# EasyEDA schematic BUS-PSU-PowerIO.json
TITLE: Sheet_1; REV: 1.0; Date: 2025-05-27; Sheet: 1/1; Drawn By: Unknownmephi; Company: Your Company
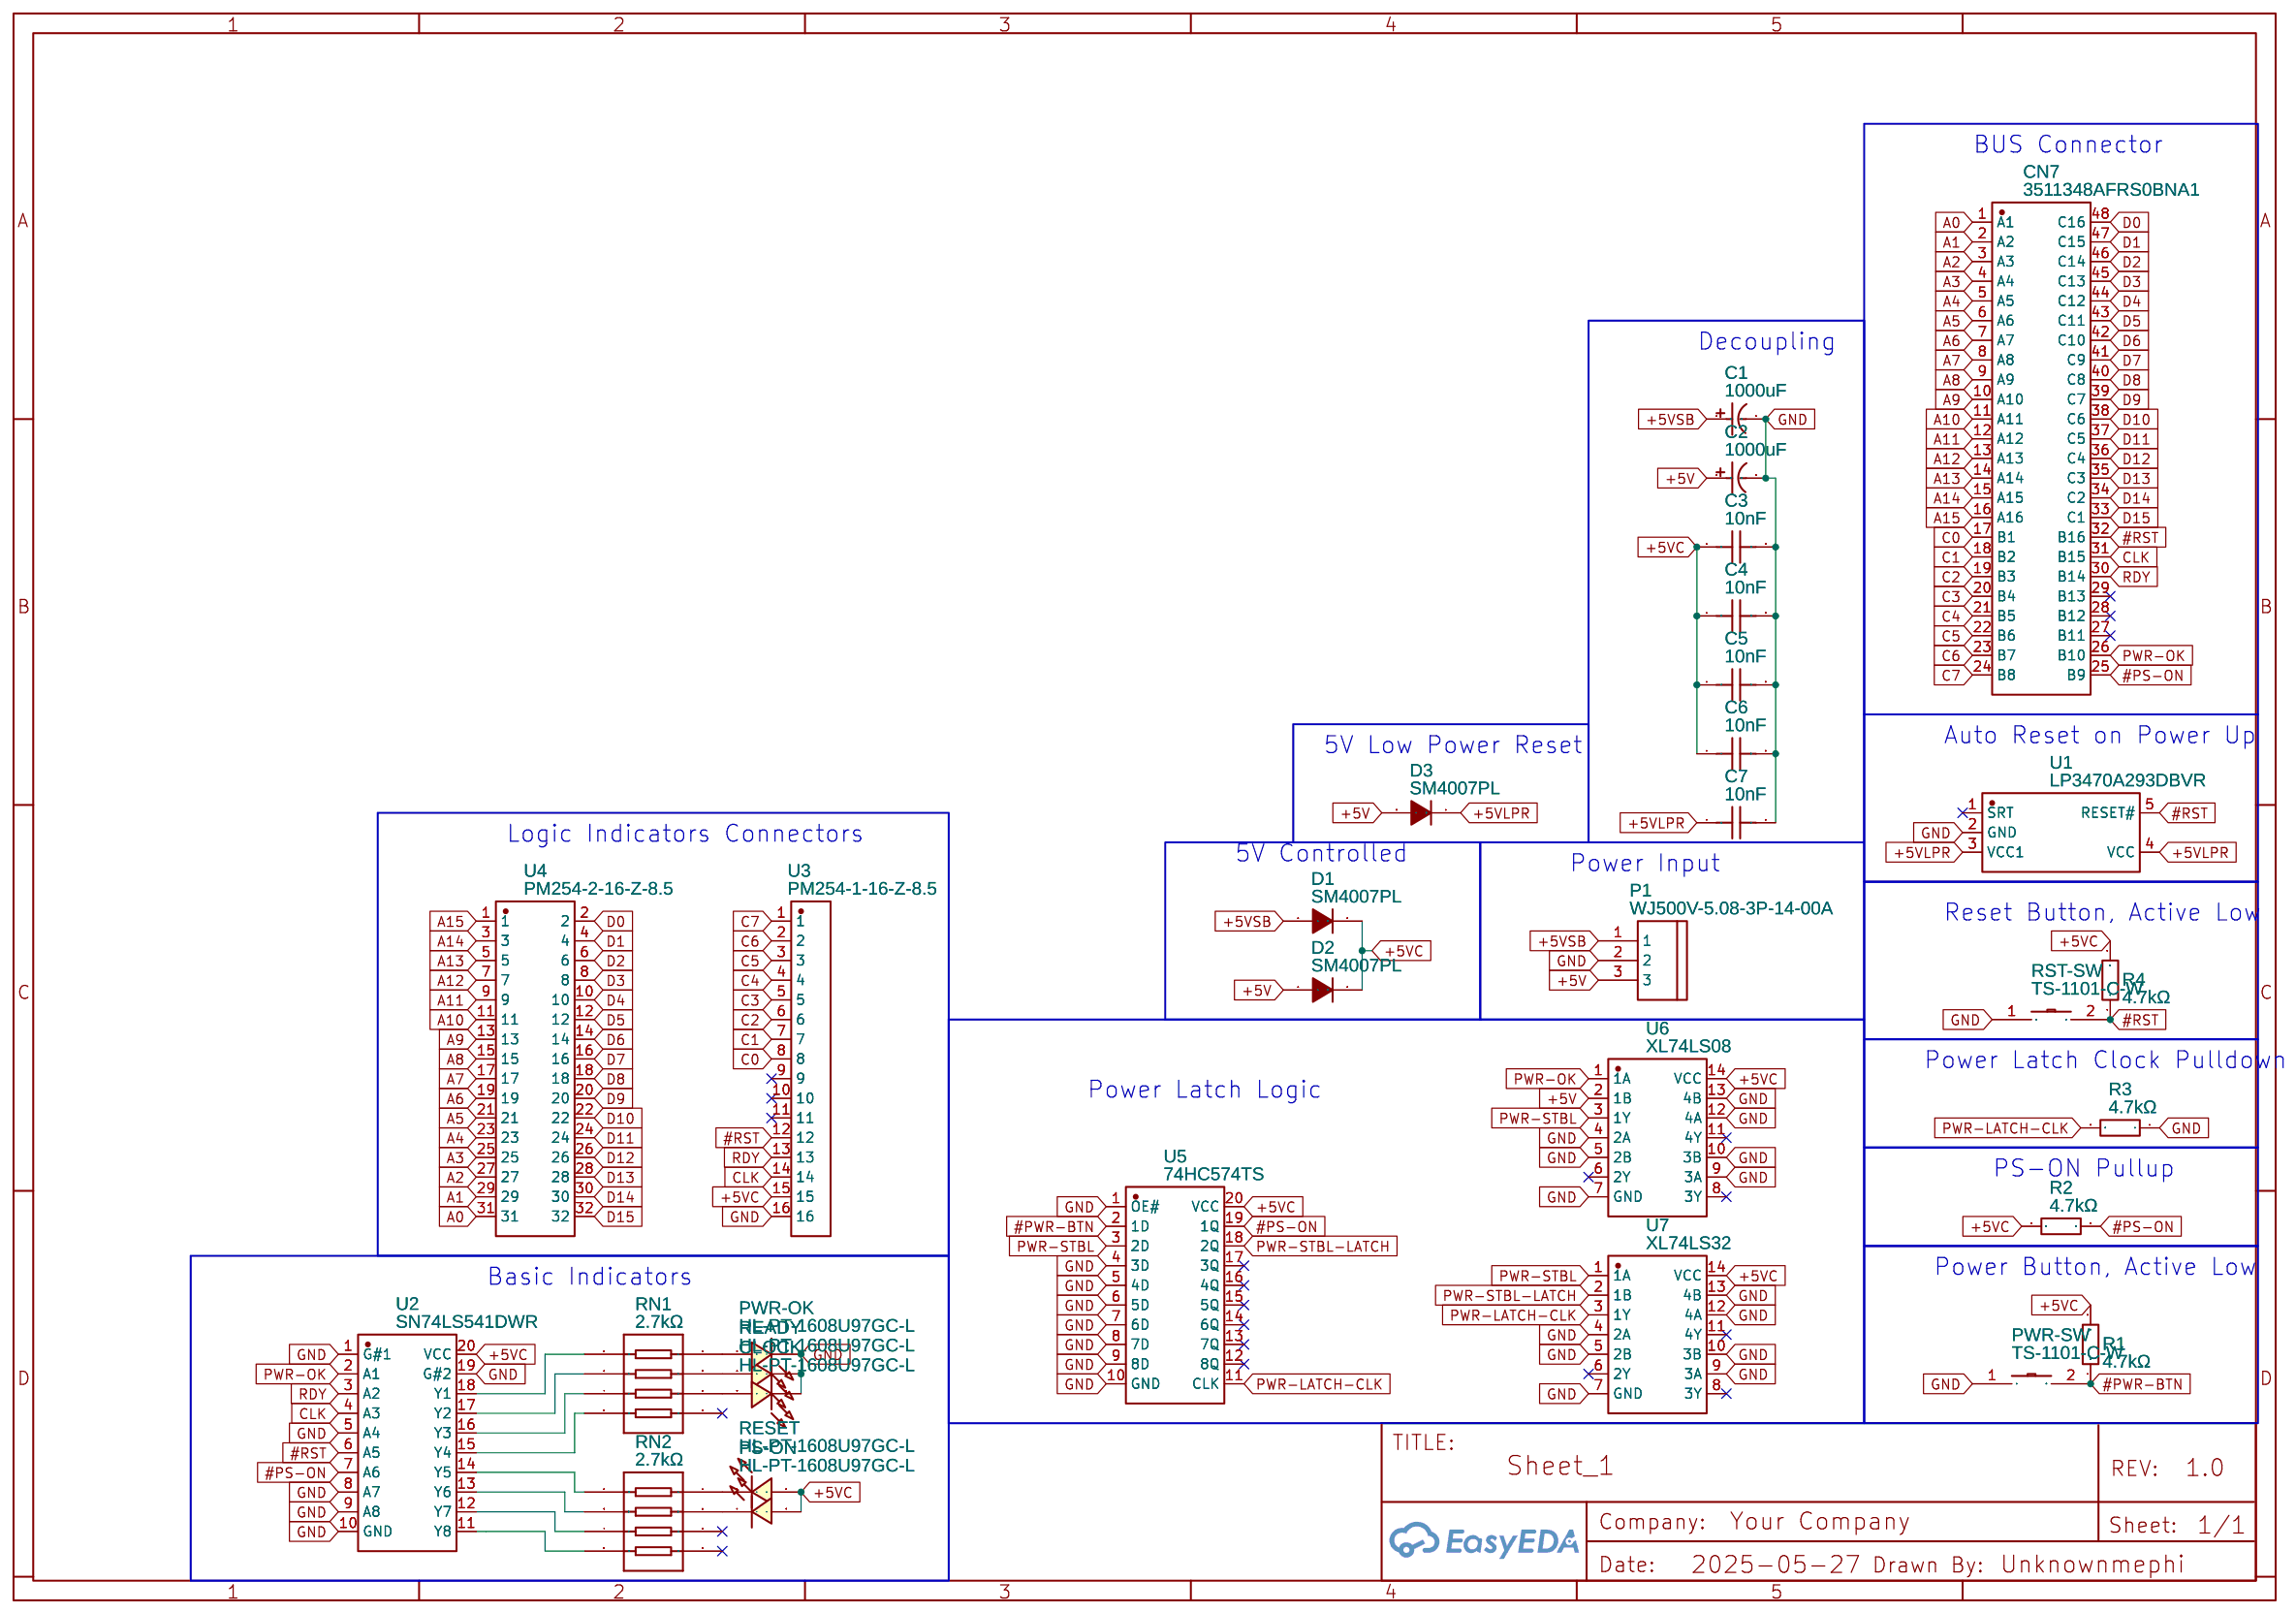
[diagram p0: schematic sheet]

## Parts
C1  1000uF  [CAP-TH_BD8.0-P3.50-D0.6-FD]
C2  1000uF  [CAP-TH_BD8.0-P3.50-D0.6-FD]
C3  10nF  [C0805]
C4  10nF  [C0805]
C5  10nF  [C0805]
C6  10nF  [C0805]
C7  10nF  [C0805]
CLOCK  HL-PT-1608U97GC-L  [LED0603-RD_GREEN]
CN7  3511348AFRS0BNA1  [CONN-TH_3511348AFRS0BNA1]
D1  SM4007PL  [SOD-123F_L2.8-W1.8-LS3.7-RD]
D2  SM4007PL  [SOD-123F_L2.8-W1.8-LS3.7-RD]
D3  SM4007PL  [SOD-123F_L2.8-W1.8-LS3.7-RD]
P1  WJ500V-5.08-3P-14-00A  [CONN-TH_3P-P5.00_WJ500V-5.08-3P]
PS-ON  HL-PT-1608U97GC-L  [LED0603-RD_GREEN]
PWR-OK  HL-PT-1608U97GC-L  [LED0603-RD_GREEN]
PWR-SW  TS-1101-C-W  [SW-SMD_L6.0-W3.3-LS8.0]
R1  4.7kΩ  [R0805]
R2  4.7kΩ  [R0805]
R3  4.7kΩ  [R0805]
R4  4.7kΩ  [R0805]
READY  HL-PT-1608U97GC-L  [LED0603-RD_GREEN]
RESET  HL-PT-1608U97GC-L  [LED0603-RD_GREEN]
RN1  2.7kΩ  [RES-ARRAY-SMD_0603-8P-L3.2-W1.6-BL]
RN2  2.7kΩ  [RES-ARRAY-SMD_0603-8P-L3.2-W1.6-BL]
RST-SW  TS-1101-C-W  [SW-SMD_L6.0-W3.3-LS8.0]
U1  LP3470A293DBVR  [SOT-23-5_L2.9-W1.6-P0.95-LS2.8-BR]
U2  SN74LS541DWR  [SOIC-20_L12.8-W7.5-P1.27-LS10.3-BL]
U3  PM254-1-16-Z-8.5  [HDR-TH_16P-P2.54-V-F-A]
U4  PM254-2-16-Z-8.5  [HDR-TH_32P-P2.54-V-F-R2-C16-S2.54]
U5  74HC574TS  [SOIC-20_L13.0-W7.6-P1.27-LS10.3-BL]
U6  XL74LS08  [SOP-14_L8.6-W3.9-P1.27-LS6.0-BL]
U7  XL74LS32  [SOP-14_L8.6-W3.9-P1.27-LS6.0-BL]

## Library data of the parts
C1 C2 = 1000uF 10V 8*12: Supplier: LCSC; Manufacturer: CX(承兴); Manufacturer Part: KM108M010F12RR0VH2FP0; Supplier Part: C10752; JLCPCB Part Class: Extended Part
C3-C7 = CC0805KRX7R9BB103: Supplier: LCSC; Manufacturer: YAGEO(国巨); Supplier Part: C83170; JLCPCB Part Class: Extended Part
CLOCK PS-ON PWR-OK READY RESET = HL-PT-1608U97GC-L: Contributor: LCSC; Supplier: LCSC; Supplier Part: C497917; Manufacturer: HONGLITRONIC(鸿利光电); JLCPCB Part Class: Extended Part
CN7 = 3511348AFRS0BNA1: Contributor: LCSC; Supplier: LCSC; Supplier Part: C963717; Manufacturer: JILN(锦凌); JLCPCB Part Class: Extended Part
D1-D3 = SM4007PL: Supplier: LCSC; Manufacturer: MDD(辰达半导体); Supplier Part: C64898; JLCPCB Part Class: Basic Part
P1 = WJ500V-5.08-3P-14-00A: Supplier: LCSC; Manufacturer: KANGNEX(康奈克斯电气); Manufacturer Part: WJ500V-5.08-3P; Supplier Part: C72334; JLCPCB Part Class: Extended Part
PWR-SW RST-SW = TS-1101-C-W: Contributor: LCSC; Supplier: LCSC; Supplier Part: C318938; Manufacturer: XKB Connectivity(中国星坤); JLCPCB Part Class: Extended Part
R1-R4 = 0805W8F4701T5E: Supplier: LCSC; Manufacturer: UNI-ROYAL(厚声); Supplier Part: C17673; JLCPCB Part Class: Basic Part
RN1 RN2 = RTA03-4D272JTP: Supplier: LCSC; Manufacturer: RALEC(旺诠); Supplier Part: C102660; JLCPCB Part Class: Extended Part
U1 = LP3470A293DBVR: Contributor: lcsc; Supplier: LCSC; Supplier Part: C701947; Manufacturer: TI(德州仪器); JLCPCB Part Class: Extended Part
U2 = SN74LS541DWR: Contributor: LCSC; Supplier: LCSC; Supplier Part: C2675558; Manufacturer: TI(德州仪器); JLCPCB Part Class: Extended Part
U3 = PM254-1-16-Z-8.5: Contributor: LCSC; Supplier: LCSC; Supplier Part: C2897379; Manufacturer: HCTL(华灿天禄); JLCPCB Part Class: Extended Part
U4 = PM254-2-16-Z-8.5: Contributor: LCSC; Supplier: LCSC; Supplier Part: C2897417; Manufacturer: HCTL(华灿天禄); JLCPCB Part Class: Extended Part
U5 = 74HC574TS: Supplier: LCSC; Supplier Part: C19818859; Manufacturer: GR(国睿); Contributor: lcsc; JLCPCB Part Class: Extended Part
U6 = XL74LS08: Contributor: LCSC; Supplier: LCSC; Supplier Part: C521140; Manufacturer: XINLUDA(信路达); JLCPCB Part Class: Extended Part
U7 = XL74LS32: Contributor: LCSC; Supplier: LCSC; Supplier Part: C521171; Manufacturer: XINLUDA(信路达); JLCPCB Part Class: Extended Part

## Nets
+5V: C2.1 D2.2(A) D3.2(A) P1.3 U6.2(1B)
+5VC: C3.1 C4.1 C5.1 C6.1 D1.1(C) D2.1(C) PS-ON.2(+) R1.2 R2.2 R4.2 RESET.2(+) U2.20(VCC) U3.15 U5.20(VCC) U6.14(VCC) U7.14(VCC)
+5VLPR: C7.1 D3.1(C) U1.3(VCC1) U1.4(VCC)
+5VSB: C1.1 D1.2(A) P1.1
GND: C1.2 C2.2 C3.2 C4.2 C5.2 C6.2 C7.2 CLOCK.1(-) P1.2 PWR-OK.1(-) PWR-SW.1 R3.1 READY.1(-) RST-SW.1 U1.2(GND) U2.1(G#1) U2.5(A4) U2.8(A7) U2.9(A8) U2.10(GND) U2.19(G#2) U3.16 U5.1(OE#) U5.4(3D) U5.5(4D) U5.6(5D) U5.7(6D) U5.8(7D) U5.9(8D) U5.10(GND) U6.4(2A) U6.5(2B) U6.7(GND) U6.9(3A) U6.10(3B) U6.12(4A) U6.13(4B) U7.4(2A) U7.5(2B) U7.7(GND) U7.9(3A) U7.10(3B) U7.12(4A) U7.13(4B)
#PS-ON: CN7.25(B9) R2.1 U2.7(A6) U5.19(1Q)
#PWR-BTN: PWR-SW.2 R1.1 U5.2(1D)
#RST: CN7.32(B16) R4.1 RST-SW.2 U1.5(RESET#) U2.6(A5) U3.12
A0: CN7.1(A1) U4.31
A1: CN7.2(A2) U4.29
A2: CN7.3(A3) U4.27
A3: CN7.4(A4) U4.25
A4: CN7.5(A5) U4.23
A5: CN7.6(A6) U4.21
A6: CN7.7(A7) U4.19
A7: CN7.8(A8) U4.17
A8: CN7.9(A9) U4.15
A9: CN7.10(A10) U4.13
A10: CN7.11(A11) U4.11
A11: CN7.12(A12) U4.9
A12: CN7.13(A13) U4.7
A13: CN7.14(A14) U4.5
A14: CN7.15(A15) U4.3
A15: CN7.16(A16) U4.1
C0: CN7.17(B1) U3.8
C1: CN7.18(B2) U3.7
C2: CN7.19(B3) U3.6
C3: CN7.20(B4) U3.5
C4: CN7.21(B5) U3.4
C5: CN7.22(B6) U3.3
C6: CN7.23(B7) U3.2
C7: CN7.24(B8) U3.1
CLK: CN7.31(B15) U2.4(A3) U3.14
D0: CN7.48(C16) U4.2
D1: CN7.47(C15) U4.4
D2: CN7.46(C14) U4.6
D3: CN7.45(C13) U4.8
D4: CN7.44(C12) U4.10
D5: CN7.43(C11) U4.12
D6: CN7.42(C10) U4.14
D7: CN7.41(C9) U4.16
D8: CN7.40(C8) U4.18
D9: CN7.39(C7) U4.20
D10: CN7.38(C6) U4.22
D11: CN7.37(C5) U4.24
D12: CN7.36(C4) U4.26
D13: CN7.35(C3) U4.28
D14: CN7.34(C2) U4.30
D15: CN7.33(C1) U4.32
PWR-LATCH-CLK: R3.2 U5.11(CLK) U7.3(1Y)
PWR-OK: CN7.26(B10) U2.2(A1) U6.1(1A)
PWR-STBL: U5.3(2D) U6.3(1Y) U7.1(1A)
PWR-STBL-LATCH: U5.18(2Q) U7.2(1B)
RDY: CN7.30(B14) U2.3(A2) U3.13
Net-(CLOCK-2): CLOCK.2(+) RN1.2
Net-(PS-ON-1): PS-ON.1(-) RN2.3
Net-(PWR-OK-2): PWR-OK.2(+) RN1.4
Net-(READY-2): READY.2(+) RN1.3
Net-(RESET-1): RESET.1(-) RN2.4
Net-(RN1-5): RN1.5 U2.18(Y1)
Net-(RN1-6): RN1.6 U2.17(Y2)
Net-(RN1-7): RN1.7 U2.16(Y3)
Net-(RN1-8): RN1.8 U2.15(Y4)
Net-(RN2-5): RN2.5 U2.14(Y5)
Net-(RN2-6): RN2.6 U2.13(Y6)
Net-(RN2-7): RN2.7 U2.12(Y7)
Net-(RN2-8): RN2.8 U2.11(Y8)

Not connected (* = marked no-connect by the designer): CN7 27(B11)* 28(B12)* 29(B13)*; RN1 1*; RN2 1* 2*; U1 1(SRT)*; U3 9* 10* 11*; U5 12(8Q)* 13(7Q)* 14(6Q)* 15(5Q)* 16(4Q)* 17(3Q)*; U6 6(2Y)* 8(3Y)* 11(4Y)*; U7 6(2Y)* 8(3Y)* 11(4Y)*

## Notes on the sheet
- BUS Connector
- Decoupling
- 5V Low Power Reset
- Auto Reset on Power Up
- Logic Indicators Connectors
- 5V Controlled
- Power Input
- Reset Button, Active Low
- Power Latch Clock Pulldown
- Power Latch Logic
- PS-ON Pullup
- Power Button, Active Low
- Basic Indicators
